# Altium schematic sheet PLL.SchDoc: PLL
size A3; Author: M.Beldyga; CompanyName: WUT ISE; DrawnBy: M.Beldyga; Organization: WUT ISE; Address1: PW ISE; Address2: Nowowiejska 15/19 00-665 Warsaw; Address3: micbeldyga@gmail.com; SheetNumber: 5; SheetTotal: 10; ModifiedBy: -; CheckedDate: -; Title2: ADC clocks; DivGrp: WUT ISE; Designer: M.Beldyga; SPICEModelCacheKGJAJCJD: <root> / <DocumentId>KGJAJCJD</DocumentId> / </root>; ModifiedDate: -; ProjectName: Sensor Box
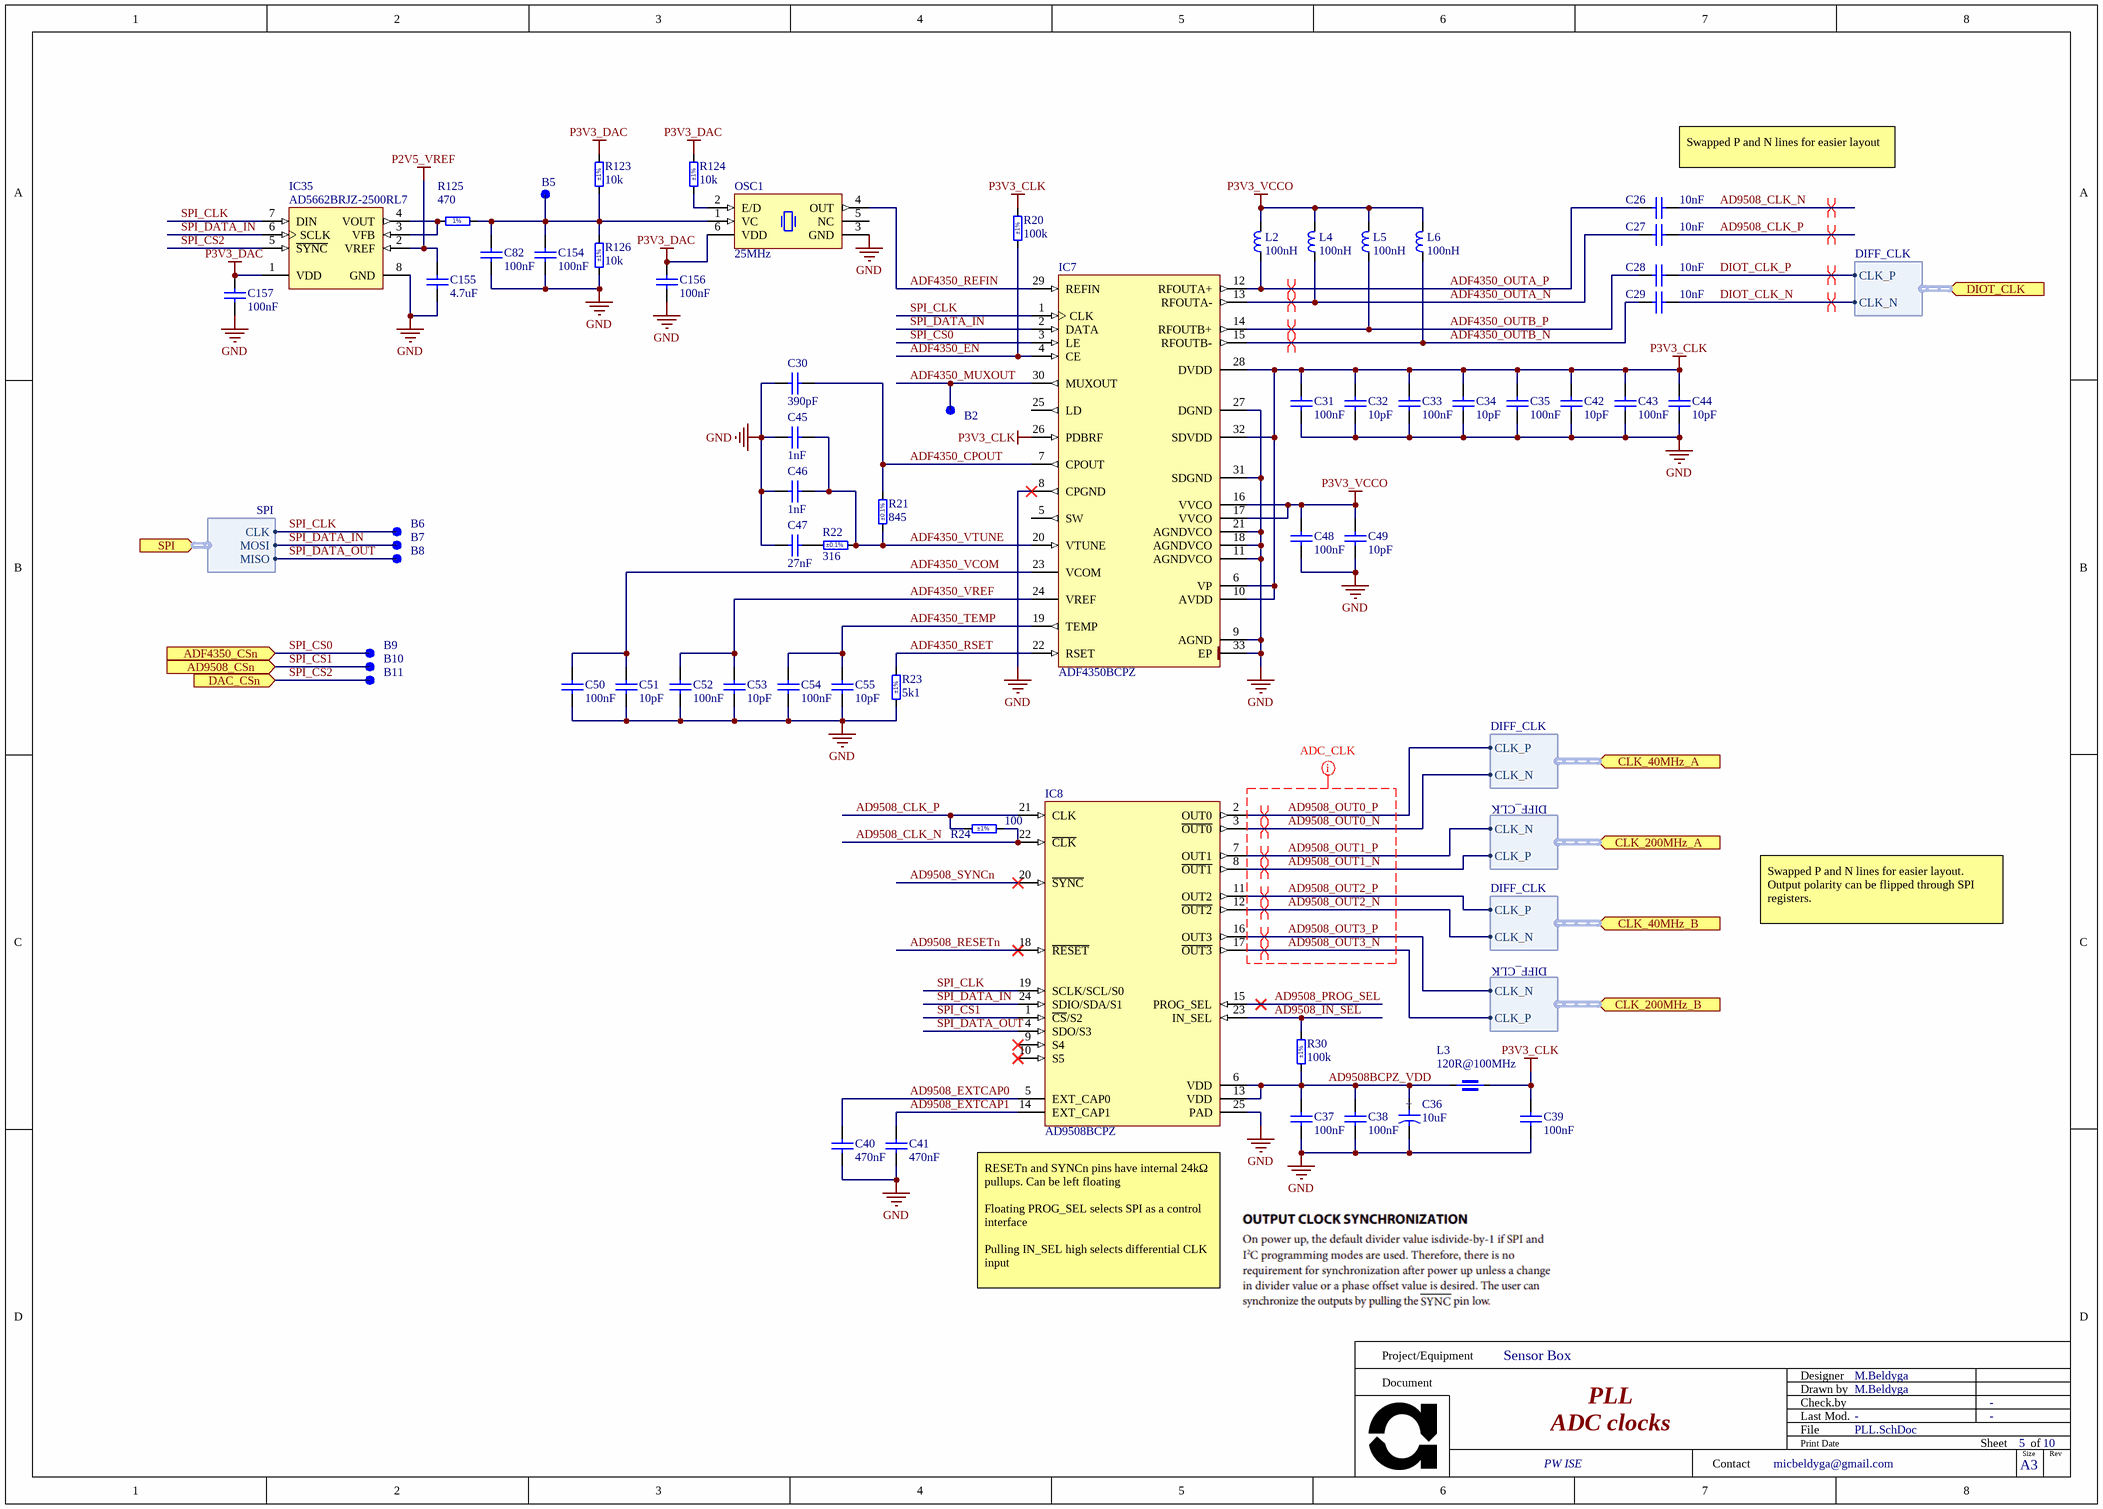
[diagram p0: PLL.SchDoc]

## Parts
B2  SMD Pad  [C100]  (value not drawn)  (no BOM)
B5  SMD Pad  [C100]  (value not drawn)  (no BOM)
B6  SMD Pad  [C100]  (value not drawn)  (no BOM)
B7  SMD Pad  [C100]  (value not drawn)  (no BOM)
B8  SMD Pad  [C100]  (value not drawn)  (no BOM)
B9  SMD Pad  [C100]  (value not drawn)  (no BOM)
B10  SMD Pad  [C100]  (value not drawn)  (no BOM)
B11  SMD Pad  [C100]  (value not drawn)  (no BOM)
C26  10nF  [CAPC1005X55N]
C27  10nF  [CAPC1005X55N]
C28  10nF  [CAPC1005X55N]
C29  10nF  [CAPC1005X55N]
C30  390pF  [CAPC1005X55N]
C31  100nF  [CAPC1005X55N]
C32  10pF  [CAPC1005X55N]
C33  100nF  [CAPC1005X55N]
C34  10pF  [CAPC1005X55N]
C35  100nF  [CAPC1005X55N]
C36  10uF  [CAPMP3216X180N]
C37  100nF  [CAPC1005X55N]
C38  100nF  [CAPC1005X55N]
C39  100nF  [CAPC1005X55N]
C40  470nF  [CAPC1005X55N]
C41  470nF  [CAPC1005X55N]
C42  10pF  [CAPC1005X55N]
C43  100nF  [CAPC1005X55N]
C44  10pF  [CAPC1005X55N]
C45  1nF  [CAPC1608X90N]
C46  1nF  [CAPC1608X90N]
C47  27nF  [CAPC1005X55N]
C48  100nF  [CAPC1005X55N]
C49  10pF  [CAPC1005X55N]
C50  100nF  [CAPC1005X55N]
C51  10pF  [CAPC1005X55N]
C52  100nF  [CAPC1005X55N]
C53  10pF  [CAPC1005X55N]
C54  100nF  [CAPC1005X55N]
C55  10pF  [CAPC1005X55N]
C82  100nF  [CAPC1005X55N]
C154  100nF  [CAPC1005X55N]
C155  4.7uF  [CAPC1608X90N]
C156  100nF  [CAPC1005X55N]
C157  100nF  [CAPC1005X55N]
IC7  ADF4350BCPZ  [QFN50P500X500X80-33N-S325]
IC8  AD9508BCPZ  [QFN50P400X400X80_HS-25N]
IC35  AD5662BRJZ-2500RL7  [SOT65P280X145-8N]
L2  100nH  [INDC1005X55N]
L3  120R@100MHz  [INDC1608X65N]
L4  100nH  [INDC1005X55N]
L5  100nH  [INDC1005X55N]
L6  100nH  [INDC1005X55N]
OSC1  25MHz  [OSC_PERICOM_FRETHE025]
R20  100k  Tolerance: ±1%  [RESC1005X40N]
R21  845  Tolerance: ±0.1%  [RESC1608X55N]
R22  316  Tolerance: ±0.1%  [RESC1608X55N]
R23  5k1  Tolerance: ±1%  [RESC1005X40N]
R24  100  Tolerance: ±1%  [RESC1005X40N]
R30  100k  Tolerance: ±1%  [RESC1005X40N]
R123  10k  Tolerance: ±1%  [RESC1005X40N]
R124  10k  Tolerance: ±1%  [RESC1005X40N]
R125  470  [RESC1005X40N]
R126  10k  Tolerance: ±1%  [RESC1005X40N]

## Ports
AD9508_CSn (in), ADF4350_CSn (in), CLK_40MHz_A (in, harness DIFF_CLK), CLK_40MHz_B (in, harness DIFF_CLK), CLK_200MHz_A (in, harness DIFF_CLK), CLK_200MHz_B (in, harness DIFF_CLK), DAC_CSn (in), DIOT_CLK (in, harness DIFF_CLK), SPI (in, harness SPI)

## Harnesses
DIFF_CLK: CLK_P, CLK_N
SPI: CLK, MOSI, MISO

## Nets
GND: C30.1 C31.1 C32.1 C33.1 C34.1 C35.1 C36.2 C37.1 C38.1 C39.1 C40.1 C41.1 C42.1 C43.1 C44.1 C45.1 C46.1 C47.1 C48.1 C49.1 C50.1 C51.1 C52.1 C53.1 C54.1 C55.1 C82.1 C154.1 C155.1 C156.1 C157.1 IC7.8(CPGND) IC7.9(AGND) IC7.11(AGNDVCO) IC7.18(AGNDVCO) IC7.21(AGNDVCO) IC7.27(DGND) IC7.31(SDGND) IC7.33(EP) IC8.25(PAD) IC35.8(GND) OSC1.3(GND) R23.1 R126.1
P2V5_VREF: C155.2 IC35.2(VREF)
P3V3_CLK: C31.2 C32.2 C33.2 C34.2 C35.2 C39.2 C42.2 C43.2 C44.2 IC7.6(VP) IC7.10(AVDD) IC7.26(PDBRF) IC7.28(DVDD) IC7.32(SDVDD) L3.1 R20.2
P3V3_DAC: C156.2 C157.2 IC35.1(VDD) OSC1.6(VDD) R123.2 R124.1
P3V3_VCCO: C48.2 C49.2 IC7.16(VVCO) IC7.17(VVCO) L2.2 L4.2 L5.2 L6.2
AD9508_CLK_N: C26.1 IC8.22(~{CLK}) R24.2
AD9508_CLK_P: C27.1 IC8.21(CLK) R24.1
AD9508_EXTCAP0: C40.2 IC8.5(EXT_CAP0)
AD9508_EXTCAP1: C41.2 IC8.14(EXT_CAP1)
AD9508_IN_SEL: IC8.23(IN_SEL) R30.2
AD9508_OUT0_N: IC8.3(~{OUT0}) ; port CLK_40MHz_A.CLK_N
AD9508_OUT0_P: IC8.2(OUT0) ; port CLK_40MHz_A.CLK_P
AD9508_OUT1_N: IC8.8(~{OUT1}) ; port CLK_200MHz_A.CLK_P
AD9508_OUT1_P: IC8.7(OUT1) ; port CLK_200MHz_A.CLK_N
AD9508_OUT2_N: IC8.12(~{OUT2}) ; port CLK_40MHz_B.CLK_N
AD9508_OUT2_P: IC8.11(OUT2) ; port CLK_40MHz_B.CLK_P
AD9508_OUT3_N: IC8.17(~{OUT3}) ; port CLK_200MHz_B.CLK_P
AD9508_OUT3_P: IC8.16(OUT3) ; port CLK_200MHz_B.CLK_N
AD9508_PROG_SEL: IC8.15(PROG_SEL)
AD9508_RESETn: IC8.18(~{RESET})
AD9508_SYNCn: IC8.20(~{SYNC})
AD9508BCPZ_VDD: C36.1 C37.2 C38.2 IC8.6(VDD) IC8.13(VDD) L3.2 R30.1
ADF4350_CPOUT: C30.2 IC7.7(CPOUT) R21.1
ADF4350_EN: IC7.4(CE) R20.1
ADF4350_MUXOUT: B2.1 IC7.30(MUXOUT)
ADF4350_OUTA_N: C27.2 IC7.13(RFOUTA-) L4.1
ADF4350_OUTA_P: C26.2 IC7.12(RFOUTA+) L2.1
ADF4350_OUTB_N: C29.2 IC7.15(RFOUTB-) L6.1
ADF4350_OUTB_P: C28.2 IC7.14(RFOUTB+) L5.1
ADF4350_REFIN: IC7.29(REFIN) OSC1.4(OUT)
ADF4350_RSET: IC7.22(RSET) R23.2
ADF4350_TEMP: C54.2 C55.2 IC7.19(TEMP)
ADF4350_VCOM: C50.2 C51.2 IC7.23(VCOM)
ADF4350_VREF: C52.2 C53.2 IC7.24(VREF)
ADF4350_VTUNE: C45.2 C46.2 IC7.20(VTUNE) R21.2 R22.2
DIOT_CLK_N: C29.1 ; port DIOT_CLK.CLK_N
DIOT_CLK_P: C28.1 ; port DIOT_CLK.CLK_P
SPI_CLK: B6.1 IC7.1(CLK) IC8.19(SCLK/SCL/S0) IC35.7(DIN) ; port SPI.CLK
SPI_CS0: B9.1 IC7.3(LE) ; port ADF4350_CSn
SPI_CS1: B10.1 IC8.1(~{CS}/S2) ; port AD9508_CSn
SPI_CS2: B11.1 IC35.5(~{SYNC}) ; port DAC_CSn
SPI_DATA_IN: B7.1 IC7.2(DATA) IC8.24(SDIO/SDA/S1) IC35.6(SCLK) ; port SPI.MOSI
SPI_DATA_OUT: B8.1 IC8.4(SDO/S3) ; port SPI.MISO
NetB5_1: B5.1 C82.2 C154.2 OSC1.1(VC) R123.1 R125.2 R126.2
NetC47_2: C47.2 R22.1
NetIC35_3: IC35.3(VFB) IC35.4(VOUT) R125.1
NetOSC1_2: OSC1.2(E/D) R124.2

Not connected (* = marked no-connect by the designer): IC7 5(SW) 25(LD); IC8 9(S4)* 10(S5)*; OSC1 5(NC)

## Layout directives
differential pair; net class D100: AD9508_CLK_N, AD9508_CLK_P, AD9508_OUT0_N, AD9508_OUT0_P, AD9508_OUT1_N, AD9508_OUT1_P, AD9508_OUT2_N, AD9508_OUT2_P, AD9508_OUT3_N, AD9508_OUT3_P, ADF4350_OUTA_N, ADF4350_OUTA_P, ADF4350_OUTB_N, ADF4350_OUTB_P, DIOT_CLK_N, DIOT_CLK_P
net class ADC_CLK: AD9508_OUT0_N, AD9508_OUT0_P, AD9508_OUT1_N, AD9508_OUT1_P, AD9508_OUT2_N, AD9508_OUT2_P, AD9508_OUT3_N, AD9508_OUT3_P

## Notes on the sheet
- (near C26) Swapped P and N lines for easier layout
- Swapped P and N lines for easier layout. Output polarity can be flipped through SPI registers.
- (near IC8) RESETn and SYNCn pins have internal 24kΩ pullups. Can be left floating
  Floating PROG_SEL selects SPI as a control interface
  Pulling IN_SEL high selects differential CLK input
- Project/Equipment
- Document
- Designer
- Drawn by
- Check.by
- Contact
- File
- Last Mod.
- Print Date
- Sheet
- Size
- A3
- of
- Rev
- (in symbol CTE3216-18_10UF_16V_20%_AVX_TCJ) +
- (in symbol R0402_470R_1%_0.0625W_100PPM) 1%

## Library data of the parts
B2 B5-B11 = SMD_PAD_D1MM: Pad; Part Description: 1mm Diameter SMD Pad; Mounted: No; Part Number: SMD_PAD_D1MM; Component Type: Standard (No BOM); Pin Count: 1; Family: SMD Pad; Socket: No; SMD: Yes; Sense: No; Status: None; ComponentHeight: 0mm; HelpURL: Undefined; Author: CERN DEM JLC; CreateDate: 10/10/2017; LatestRevisionDate: 10/10/2017; PackageDescription: 1mm Diameter SMD Pad
C26-C29 = CC0402_10NF_16V_10%_X7R: Non-polarised capacitor; Part Description: SMD Multilayer Chip Ceramic Capacitor; Manufacturer: GENERIC; Manufacturer1 Part Number: 223878715636; Voltage: 16V; TC: X7R; Tolerance: ±10%; Part Number: CC0402_10NF_16V_10%_X7R; Component Kind: Standard; Component Type: Standard; Pin Count: 2; Value: 10nF; Status: Not Recommended; Manufacturer Part Number: CC0402_10NF_16V_10%_X7R; Case: 0402; Mounted: Yes; Socket: No; SMD: Yes; Sense: No; Manufacturer1 Example: PHYCOMP; Manufacturer1 ComponentHeight: 0.55mm; HelpURL: \\cern.ch\dfs\Applications\Altium\Datasheets\CC0402_X7R_PHYCOMP.pdf; Author: CERN DEM JLC; CreateDate: 12/3/2007; LatestRevisionDate: 12/3/2007
C30 = CC0402_390PF_50V_1%_C0G_MURATA_GCM1555C1H391FA16: Non-polarised capacitor; Part Description: Chip Multilayer Ceramic Capacitor for Automotive; Manufacturer: MURATA; Voltage: 50V; TC: C0G/NP0; Tolerance: ±1%; Part Number: CC0402_390PF_50V_1%_C0G_MURATA_GCM1555C1H391FA16; Component Kind: Standard; Component Type: Standard; Pin Count: 2; Value: 390pF; Status: None; Manufacturer Part Number: GCM1555C1H391FA16; Case: 0402; Mounted: Yes; Socket: No; SMD: Yes; Sense: No; ComponentHeight: 0.55mm; HelpURL: \\cern.ch\dfs\Applications\Altium\Datasheets\CC0402_MURATA_GCM1555C1H391FA16.pdf; Author: CERN DEM BC; CreateDate: 9/2/2020; LatestRevisionDate: 9/2/2020
C31 C33 C35 C37-C39 C43 C48 C50 C52 C54 C82 C154 C156 C157 = CC0402_100NF_50V_10%_X7R: Non-polarised capacitor; Part Description: SMD Multilayer Chip Ceramic Capacitor; Manufacturer: GENERIC; Manufacturer1 Part Number: GRM155R71H104KE14D; Voltage: 50V; TC: X7R; Tolerance: ±10%; Part Number: CC0402_100NF_50V_10%_X7R; Component Kind: Standard; Component Type: Standard; Pin Count: 2; Value: 100nF; Status: None; Manufacturer Part Number: CC0402_100NF_50V_10%_X7R; Case: 0402; Mounted: Yes; Socket: No; SMD: Yes; Sense: No; Manufacturer1 Example: MURATA; Manufacturer1 ComponentHeight: 0.55mm; HelpURL: \\cern.ch\dfs\Applications\Altium\Datasheets\CC0402_MURATA_GRM155R71H104KE14D.pdf; Author: CERN DEM MR; CreateDate: 6/30/2017; LatestRevisionDate: 6/30/2017
C32 C34 C42 C44 C49 C51 C53 C55 = CC0402_10PF_50V_5%_C0G: Non-polarised capacitor; Part Description: SMD Multilayer Chip Ceramic Capacitor; Manufacturer: GENERIC; Manufacturer1 Part Number: C0402C100J5GACTU; Voltage: 50V; TC: C0G/NP0; Tolerance: ±5%; Part Number: CC0402_10PF_50V_5%_C0G; Component Kind: Standard; Component Type: Standard; Pin Count: 2; Value: 10pF; Status: Preferred; Manufacturer Part Number: CC0402_10PF_50V_5%_C0G; Case: 0402; Mounted: Yes; Socket: No; SMD: Yes; Sense: No; Manufacturer1 Example: KEMET; Manufacturer1 ComponentHeight: 0.55mm; HelpURL: \\cern.ch\dfs\Applications\Altium\Datasheets\CC0402_C0G_KEMET_(Commercial Grade).pdf; Author: CERN DEM JLC; CreateDate: 12/3/2007; LatestRevisionDate: 4/22/2015
C36 = CTE3216-18_10UF_16V_20%_AVX_TCJ: Polarised capacitor; Part Description: ESR 0R200 Tantalum Solid Electrolytic Chip Capacitor with Conductive Polymer Electrode; Manufacturer: AVX; Manufacturer Part Number: TCJA106M016R0200; Voltage: 16V; Tolerance: ±20%; Part Number: CTE3216-18_10UF_16V_20%_AVX_TCJ; Component Kind: Standard; Component Type: Standard; Pin Count: 2; Value: 10uF; Status: Preferred; Case: A; Mounted: Yes; Socket: No; SMD: Yes; Sense: No; ComponentHeight: 1.8mm; HelpURL: \\cern.ch\dfs\Applications\Altium\Datasheets\CTE_AVX_TCJ.pdf; Author: CERN DEM JLC; CreateDate: 3/29/2012; LatestRevisionDate: 3/29/2012
C40 C41 = CC0402_470NF_16V_10%_X5R: Non-polarised capacitor; Part Description: SMD Multilayer Chip Ceramic Capacitor; Manufacturer: GENERIC; Manufacturer1 Part Number: C1005X5R1C105KT; Voltage: 16V; TC: X5R; Tolerance: ±10%; Part Number: CC0402_470NF_16V_10%_X5R; Component Kind: Standard; Component Type: Standard; Pin Count: 2; Value: 470nF; Status: Preferred; Manufacturer Part Number: CC0402_470NF_16V_10%_X5R; Case: 0402; Mounted: Yes; Socket: No; SMD: Yes; Sense: No; Manufacturer1 Example: TDK; Manufacturer1 ComponentHeight: 0.55mm; HelpURL: \\cern.ch\dfs\Applications\Altium\Datasheets\CC0402_X5R_TDK_C.pdf; Author: CERN DEM JLC; CreateDate: 10/25/2012; LatestRevisionDate: 10/25/2012
C45 C46 = CC0603_1NF_50V_1%_NP0: Non-polarised capacitor; Part Description: SMD Multilayer Chip Ceramic Capacitor; Manufacturer: GENERIC; Manufacturer1 Part Number: 06035A102FAT2A; Voltage: 50V; TC: C0G/NP0; Tolerance: ±1%; Part Number: CC0603_1NF_50V_1%_NP0; Component Kind: Standard; Component Type: Standard; Pin Count: 2; Value: 1nF; Status: None; Manufacturer Part Number: CC0603_1NF_50V_1%_NP0; Case: 0603; Mounted: Yes; Socket: No; SMD: Yes; Sense: No; Manufacturer1 Example: AVX; Manufacturer1 ComponentHeight: 0.9mm; HelpURL: \\cern.ch\dfs\Applications\Altium\Datasheets\CC0603_C0G_AVX.pdf; Author: CERN DEM JLC; CreateDate: 6/15/2017; LatestRevisionDate: 6/15/2017
C47 = CC0402_27NF_25V_10%_X7R: Non-polarised capacitor; Part Description: SMD Multilayer Chip Ceramic Capacitor; Manufacturer: GENERIC; Manufacturer1 Part Number: C0402C273K3RACTU; Voltage: 25V; TC: X7R; Tolerance: ±10%; Part Number: CC0402_27NF_25V_10%_X7R; Component Kind: Standard; Component Type: Standard; Pin Count: 2; Value: 27nF; Status: Preferred; Manufacturer Part Number: CC0402_27NF_25V_10%_X7R; Case: 0402; Mounted: Yes; Socket: No; SMD: Yes; Sense: No; Manufacturer1 Example: KEMET; Manufacturer1 ComponentHeight: 0.55mm; HelpURL: \\cern.ch\dfs\Applications\Altium\Datasheets\CC0402_X7R_KEMET.pdf; Author: CERN DEM JLC; CreateDate: 3/9/2017; LatestRevisionDate: 3/9/2017
C155 = CC0603_4.7UF_25V_10%_X5R: Non-polarised capacitor; Part Description: SMD Multilayer Chip Ceramic Capacitor; Manufacturer: GENERIC; Manufacturer1 Part Number: GRM188R61E475KE11D; Voltage: 25V; TC: X5R; Tolerance: ±10%; Part Number: CC0603_4.7UF_25V_10%_X5R; Component Kind: Standard; Component Type: Standard; Pin Count: 2; Value: 4.7uF; Status: None; Manufacturer Part Number: CC0603_4.7UF_25V_10%_X5R; Case: 0603; Mounted: Yes; Socket: No; SMD: Yes; Sense: No; Manufacturer1 Example: MURATA; Manufacturer1 ComponentHeight: 0.95mm; HelpURL: \\cern.ch\dfs\Applications\Altium\Datasheets\CC0603_MURATA_GRM188R61E475KE11D.pdf; Author: CERN DEM JLC; CreateDate: 11/10/2014; LatestRevisionDate: 11/10/2014
IC7 = ADF4350BCPZ: Wideband Synthesizer with Integrated VCO; Manufacturer: Analog Devices; Manufacturer Part Number: ADF4351BCP; Part Number: ADF4350BCPZ; Component Kind: Standard; Component Type: Standard; Device: ADF4350BCPZ; PackageDescription: QFN, (MO-220-WHHD) 0.50mm Pitch, Square; 32 Pin, 5.00mm L X 5.00mm W X 0.80mm H body (w/Thermal Tab 3.25 X 3.25mm), IPC Medium Density; Part Description: Wideband Synthesizer with Integrated VCO; Pin Count: 33; Case: QFN; Status: Active; Author: Michal Beldyga; CreateDate: 2/17/2025; LastRevision: 2/17/2025
IC8 = AD9508BCPZ: 1.65 GHz Clock Fanout Buffer with Output Dividers and Delay Adjust; Manufacturer: Analog Devices; Part Number: AD9508BCPZ; Component Kind: Standard; Component Type: Standard; Device: AD9508BCPZ; PackageDescription: QFN, 24-Leads, Body 4.00x4.00mm, Pitch 0.50mm, Thermal Pad 2.30x2.30mm, IPC Medium Density; Part Description: 1.65 GHz Clock Fanout Buffer with Output Dividers and Delay Adjust; Manufacturer Part Number: AD9508BCPZ; Pin Count: 25; Case: QFN; Status: Active; Author: Michal Beldyga; CreateDate: 2/8/2025; LastRevision: 2/8/2025
IC35 = AD5662BRJZ-2500RL7: 2.7V to 5.5V, 250µA, Rail-to-Rail Output 16-Bit nanoDAC; Manufacturer: ANALOG DEVICES; PressFit: No; Bonding: No; Part Number: AD5662BRJZ-2500RL7; Component Kind: Standard; Component Type: Standard; Device: AD5662BRJZ-2500RL7; PackageDescription: SOT, 0.65mm pitch; 8 pin, 1.625mm W X 2.90mm L X 1.45mm H body, IPC Medium Density; Part Description: 2.7V to 5.5V, 250μA, Rail-to-Rail Output 16-Bit nanoDAC; Manufacturer Part Number: AD5662BRJZ-2; Pin Count: 8; Case: SOT23-8; Mounted: Yes; Socket: No; SMD: Yes; Sense: No; ComponentHeight: 1.45mm; Author: CERN DEM JLC; HelpURL: \\cern.ch\dfs\Applications\Altium\Datasheets\AD5662BRJZ-2500RL7.pdf; CreateDate: 5/9/2012; LatestRevisionDate: 3/25/2022
L2 L4-L6 = IND0402_100NH_5%_JOHANSON_ L-07CR10JV6T: Inductor; Part Description: RF Ceramic Chip Inductor; Manufacturer: Johanson Technology; Manufacturer Part Number: LRC0402CJR10GV001T; Current: 100mA; Tolerance: ±5%; Part Number: IND0402_100NH_5%_JOHANSON_ L-07CR10JV6T; Component Kind: Standard; Component Type: Standard; Pin Count: 2; Value: 100nH; DC Resistance: N/A; Status: Active; ComponentHeight: 0.5mm; SMD: Yes; Author: Michal Beldyga; CreateDate: 2/17/2025; LatestRevisionDate: 2/17/2025
L3 = IND0603_MURATA_BLM18SG121TN1D: Part Description: SMD EMIFIL Suppression Chip Ferrite Bead; Manufacturer: MURATA; Power: 3A; Resistance: 0.025R; Tolerance: ±25%; Part Number: IND0603_MURATA_BLM18SG121TN1D; Component Kind: Standard; Component Type: Standard; Pin Count: 2; Value: 120R@100MHz; Manufacturer Part Number: BLM18SG121TN1D; Case: 0603; Mounted: Yes; Socket: No; SMD: Yes; Sense: No; ComponentHeight: 0.65mm; HelpURL: \\cern.ch\dfs\Applications\Altium\Datasheets\IND0603_MURATA_BLM18S.pdf; Author: CERN DEM JLC; CreateDate: 7/23/2014; LatestRevisionDate: 10/25/2018
OSC1 = OSC_25MHZ_PERICOM_FRETHE025: 3.3V CMOS 25.000MHz Ethernet VCXO; Part Description: 3.3V, ±25ppm, 15pF, -20..70°C,CMOS Ethernet VCXO; PressFit: No; Bonding: No; Part Number: OSC_25MHZ_PERICOM_FRETHE025; Component Kind: Standard; Component Type: Standard; PackageDescription: SMD Oscillator, Side Concave; 2.54mm Pitch, 6 Pins, 5.00mm L X 7.00mm W X 1.55mm H; Value: 25MHz; Manufacturer: PERICOM; Manufacturer Part Number: FRETHE025; Pin Count: 6; Mounted: Yes; Socket: No; SMD: Yes; Sense: No; ComponentHeight: 1.55mm; HelpURL: \\cern.ch\dfs\Applications\Altium\Datasheets\OSC_PERICOM_FRETHE025.pdf; Author: CERN DEM JLC; CreateDate: 5/10/2012; LatestRevisionDate: 5/10/2012
R20 R30 = R0402_100K_1%_0.0625W_100PPM: Resistor - 1%; Part Description: General Purpose Thick Film Chip Resistor; Manufacturer: GENERIC; Manufacturer1 Part Number: 232270671004L; TC: ±100ppm/°C; PressFit: No; Part Number: R0402_100K_1%_0.0625W_100PPM; Component Kind: Standard; Component Type: Standard; Pin Count: 2; Value: 100k; Status: Not Recommended; Power: 0.0625W; Manufacturer Part Number: R0402_100K_1%_0.0625W_100PPM; Case: 0402; Mounted: Yes; Sense: No; Socket: No; SMD: Yes; Manufacturer1 Example: YAGEO PHYCOMP; Manufacturer1 ComponentHeight: 0.4mm; HelpURL: \\cern.ch\dfs\Applications\Altium\Datasheets\R0402_Phycomp_RC0402.pdf; Author: CERN DEM JLC; CreateDate: 12/3/2007; LatestRevisionDate: 10/17/2012
R21 = R0603_845R_0.1%_0.063W_10PPM: Resistor - 0.1%; Part Description: Thin Film Chip Resistor; Manufacturer: GENERIC; Manufacturer1 Part Number: RN73C1J845RBTDF; Power: 0.063W; TC: ±10ppm; PressFit: No; Part Number: R0603_845R_0.1%_0.063W_10PPM; Component Kind: Standard; Component Type: Standard; Pin Count: 2; Value: 845; Status: Not Recommended; Manufacturer Part Number: R0603_845R_0.1%_0.063W_10PPM; Case: 0603; Mounted: Yes; Sense: No; Socket: No; SMD: Yes; Manufacturer1 Example: TYCO HOLSWORTHY; Manufacturer1 ComponentHeight: 0.5mm; HelpURL: \\cern.ch\dfs\Applications\Altium\Datasheets\R0603_Tyco_RN73.pdf; Author: CERN DEM JLC; CreateDate: 12/3/2007; LatestRevisionDate: 3/13/2008
R22 = R0603_316R_0.1%_0.063W_10PPM: Resistor - 0.1%; Part Description: Thin Film Chip Resistor; Manufacturer: GENERIC; Manufacturer1 Part Number: RN73C1J316RBTDF; Power: 0.063W; TC: ±10ppm; PressFit: No; Part Number: R0603_316R_0.1%_0.063W_10PPM; Component Kind: Standard; Component Type: Standard; Pin Count: 2; Value: 316; Status: Not Recommended; Manufacturer Part Number: R0603_316R_0.1%_0.063W_10PPM; Case: 0603; Mounted: Yes; Sense: No; Socket: No; SMD: Yes; Manufacturer1 Example: TYCO HOLSWORTHY; Manufacturer1 ComponentHeight: 0.5mm; HelpURL: \\cern.ch\dfs\Applications\Altium\Datasheets\R0603_Tyco_RN73.pdf; Author: CERN DEM JLC; CreateDate: 12/3/2007; LatestRevisionDate: 3/13/2008
R23 = R0402_5K1_1%_0.0625W_100PPM: Resistor - 1%; Part Description: General Purpose Thick Film Chip Resistor; Manufacturer: GENERIC; Manufacturer1 Part Number: 232270675102L; TC: ±100ppm/°C; PressFit: No; Part Number: R0402_5K1_1%_0.0625W_100PPM; Component Kind: Standard; Component Type: Standard; Pin Count: 2; Value: 5k1; Status: Not Recommended; Power: 0.0625W; Manufacturer Part Number: R0402_5K1_1%_0.0625W_100PPM; Case: 0402; Mounted: Yes; Sense: No; Socket: No; SMD: Yes; Manufacturer1 Example: YAGEO PHYCOMP; Manufacturer1 ComponentHeight: 0.4mm; HelpURL: \\cern.ch\dfs\Applications\Altium\Datasheets\R0402_Phycomp_RC0402.pdf; Author: CERN DEM JLC; CreateDate: 12/3/2007; LatestRevisionDate: 10/17/2012
R24 = R0402_100R_1%_0.1W_100PPM: Resistor - 1%; Part Description: General Purpose Thick Film Chip Resistor; Manufacturer: GENERIC; Manufacturer Part Number: R0402_100R_1%_0.1W_100PPM_50V; Manufacturer1 Part Number: ERJ2RKF1000X; Power: 0.1W; TC: ±100ppm/°C; Voltage: 50V; PressFit: No; Part Number: R0402_100R_1%_0.1W_100PPM; Component Kind: Standard; Component Type: Standard; Pin Count: 2; Value: 100; Status: Not Recommended; Case: 0402; Mounted: Yes; Sense: No; Socket: No; SMD: Yes; Manufacturer1 Example: PANASONIC; Manufacturer1 ComponentHeight: 0.4mm; HelpURL: \\cern.ch\dfs\Applications\Altium\Datasheets\R0402_PANASONIC_ERJ2RK.pdf; Author: CERN DEM JLC; CreateDate: 12/12/2013; LatestRevisionDate: 3/3/2015
R123 R124 R126 = R0402_10K_1%_0.0625W_100PPM: Resistor - 1%; Part Description: General Purpose Thick Film Chip Resistor; Manufacturer: GENERIC; Manufacturer1 Part Number: 232270671003L; TC: ±100ppm/°C; PressFit: No; Part Number: R0402_10K_1%_0.0625W_100PPM; Component Kind: Standard; Component Type: Standard; Pin Count: 2; Value: 10k; Status: Not Recommended; Power: 0.0625W; Manufacturer Part Number: R0402_10K_1%_0.0625W_100PPM; Case: 0402; Mounted: Yes; Sense: No; Socket: No; SMD: Yes; Manufacturer1 Example: YAGEO PHYCOMP; Manufacturer1 ComponentHeight: 0.4mm; HelpURL: \\cern.ch\dfs\Applications\Altium\Datasheets\R0402_Phycomp_RC0402.pdf; Author: CERN DEM JLC; CreateDate: 12/3/2007; LatestRevisionDate: 10/17/2012
R125 = R0402_470R_1%_0.0625W_100PPM: Resistor - 1%; Part Description: General Purpose Thick Film Chip Resistor; Manufacturer: GENERIC; Manufacturer1 Part Number: 232270674701L; TC: ±100ppm/°C; PressFit: No; Part Number: R0402_470R_1%_0.0625W_100PPM; Component Kind: Standard; Component Type: Standard; Pin Count: 2; Value: 470; Status: Not Recommended; Power: 0.0625W; Tolerance: ±1%; Manufacturer Part Number: R0402_470R_1%_0.0625W_100PPM; Case: 0402; Mounted: Yes; Sense: No; Socket: No; SMD: Yes; Manufacturer1 Example: YAGEO PHYCOMP; Manufacturer1 ComponentHeight: 0.4mm; HelpURL: \\cern.ch\dfs\Applications\Altium\Datasheets\R0402_Phycomp_RC0402.pdf; Author: CERN DEM JLC; CreateDate: 12/3/2007; LatestRevisionDate: 10/17/2012